# Altium project PWR_Prj.PrjPcb
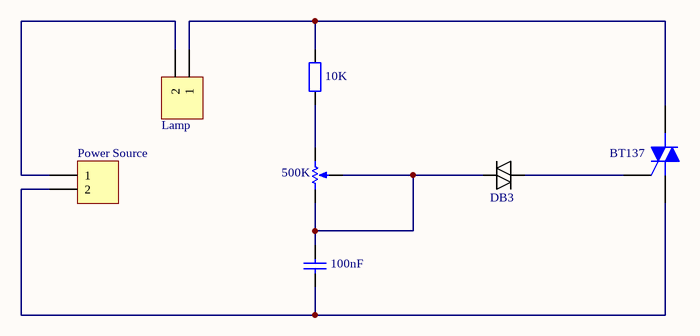
[diagram p0: Sheet1.SchDoc]
1 sheet, 7 parts. Net scope: global (net labels, ports and power ports of the same name join across sheets).
Board file: PCB1.PcbDoc

## Sheet Sheet1.SchDoc: Dimmer Devresi
size A4 portrait; Author: Esra Yilmaz; Organization: Esra Yilmaz; DocumentNumber: 160205082; SheetNumber: 1; SheetTotal: 1

### Parts
C1  value 100nF  [RAD-0.3]  (hidden comment: Cap)
D1  DB3  [*DIOAD810W51L378D176P]
D2  BT137  [369-03]
H1  Power Source  [HDR1X2]
H2  Lamp  [HDR1X2]
POT1  value 500K  [VR5]  (hidden comment: RPot)
R1  value 10K  [AXIAL-0.4]  (hidden comment: Res2)

### Nets
NetC1_1: C1.1 D1.1 POT1.1(TOP) POT1.3(TAP)
NetC1_2: C1.2 D2.1(M1) H1.2
NetD1_2: D1.2 D2.3(G)
NetD2_2: D2.2(M2) H2.1 R1.2
NetH1_1: H1.1 H2.2
NetPOT1_2: POT1.2(BOT) R1.1

### Notes on the sheet
- Title
- Size:
- Date:
- A4
- Number:
- Time:
- Revision:
- Sheet
- of
- File:

### Library data of the parts
C1 = Cap: Capacitor; Published: 8-Jun-2000; LatestRevisionDate: 17-Jul-2002; LatestRevisionNote: Re-released for DXP Platform.; PackageReference: RAD-0.3; Publisher: Altium Limited; PackageDescription: Radial Cap, Thru-Hole; 2 Leads; 0.3 in Pin Spacing
D1 = DB3TG: Rectifier Diode, 30 V, 34 V, 15 A, 2 A, DO-204AH, 2; MF: ON Semiconductor; MP: DB3TG; Price: None; Availability: Unavailable; SnapEDA_Link: https://www.snapeda.com/parts/DB3TG/ON%20Semiconductor/view-part/?ref=snap; Package: DO-35 STMicroelectronics; Value: *
D2 = Triac: Silicon Bidirectional Triode Thyristor; Note: Pin 2 is electrically connected to Pin 4 (TAB); Published: 29-Sep-2000; LatestRevisionDate: 17-Jul-2002; LatestRevisionNote: Re-released for DXP Platform.; DatasheetVersion: 1999; PackageReference: 369-03; Publisher: Altium Limited; PackageDescription: TO, Thru-Hole, Vertical, Heatsink Mounted; 3 In-Line Leads; Pitch 2.28 mm; ComponentLink1Description: Manufacturer Link; ComponentLink1URL: http://www.motorola.com/
H1 H2 = Header 2: Header, 2-Pin; LatestRevisionDate: 17-Jul-2002; LatestRevisionNote: Re-released for DXP Platform.; Publisher: Altium Limited
POT1 = RPot: Potentiometer; Sim Note: Enter the Resistance value and the set point into parameter fields.; Set Position: 0.5; Published: 8-Jun-2000; LatestRevisionDate: 17-Jul-2002; LatestRevisionNote: Re-released for DXP Platform.; PackageReference: VR5; Publisher: Altium Limited; PackageDescription: Variable Resistor, Thru-Hole; 3 Leads
R1 = Res2: Resistor; Published: 8-Jun-2000; LatestRevisionDate: 17-Jul-2002; LatestRevisionNote: Re-released for DXP Platform.; PackageReference: AXIAL-0.4; Publisher: Altium Limited; PackageDescription: Axial Device, Thru-Hole; 2 Leads; 0.4 in Pin Spacing